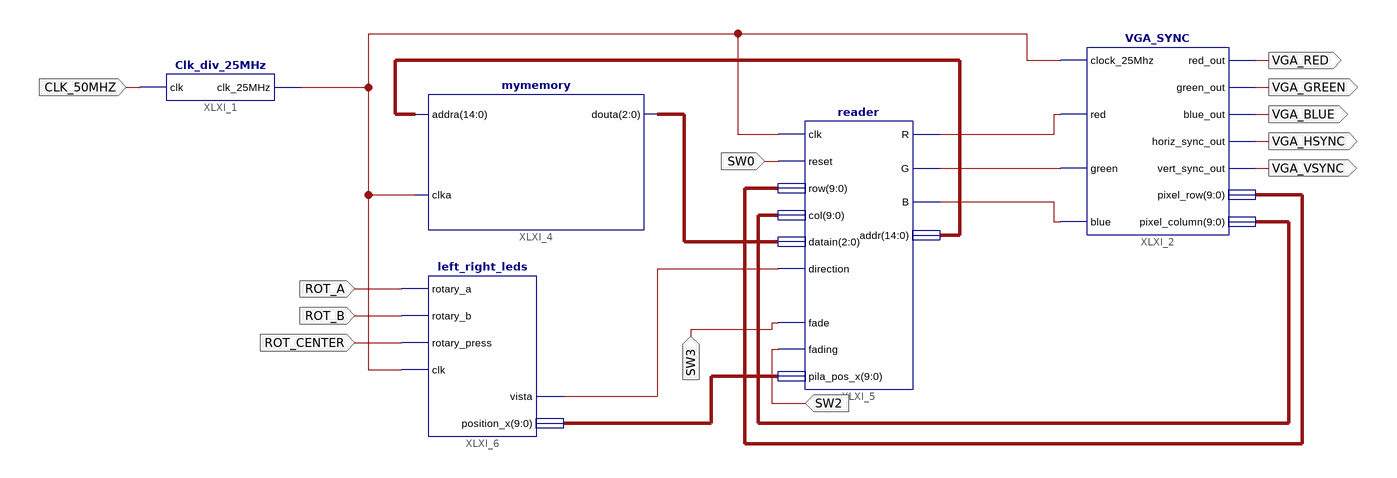
[diagram p0: schematic sheet 1]
// Xilinx ISE schematic VGA_image_tets.sch (spartan3e) as structural Verilog: 5 symbols, 12 ports
module VGA_image_tets (
  input  CLK_50MHZ,
  input  SW0,
  input  ROT_A,
  input  ROT_B,
  input  ROT_CENTER,
  input  SW3,
  input  SW2,
  output VGA_RED,
  output VGA_GREEN,
  output VGA_BLUE,
  output VGA_HSYNC,
  output VGA_VSYNC
);

  wire XLXN_24, XLXN_25, XLXN_27, XLXN_35, XLXN_44;
  wire [2:0] XLXN_40;
  wire [9:0] XLXN_38, XLXN_46, XLXN_48;
  wire [14:0] XLXN_41;

  Clk_div_25MHz XLXI_1 (.clk(CLK_50MHZ), .clk_25MHz(XLXN_35));
  VGA_SYNC XLXI_2 (
    .clock_25Mhz(XLXN_35), .red(XLXN_24), .green(XLXN_25), .blue(XLXN_27), .red_out(VGA_RED),
    .green_out(VGA_GREEN), .blue_out(VGA_BLUE), .horiz_sync_out(VGA_HSYNC), .vert_sync_out(VGA_VSYNC),
    .pixel_row(XLXN_38), .pixel_column(XLXN_46));
  mymemory XLXI_4 (.addra(XLXN_41), .clka(XLXN_35), .douta(XLXN_40));
  reader XLXI_5 (
    .clk(XLXN_35), .reset(SW0), .direction(XLXN_44), .fade(SW3), .fading(SW2), .row(XLXN_38), .col(XLXN_46),
    .datain(XLXN_40), .R(XLXN_24), .G(XLXN_25), .B(XLXN_27), .addr(XLXN_41), .pila_pos_x(XLXN_48));
  left_right_leds XLXI_6 (
    .rotary_a(ROT_A), .rotary_b(ROT_B), .rotary_press(ROT_CENTER), .clk(XLXN_35), .vista(XLXN_44),
    .position_x(XLXN_48));
endmodule
